# EAGLE design untitled (EAGLE 6.5.0)
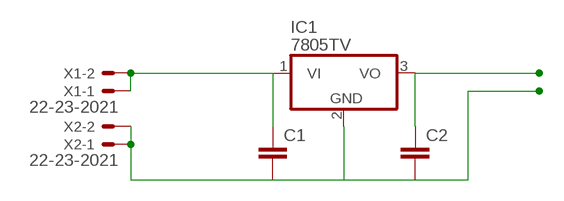
[diagram p0: schematic, sheet 1]

## Parts
C1  C-EUC1206  [C1206]
C2  C-EUC1206  [C1206]
IC1  7805TV  [TO220V]
X1  22-23-2021  [22-23-2021]
X2  22-23-2021  [22-23-2021]

## Nets
N$1: C1.1 IC1.1(VI) X1.1 X1.2
N$2: C1.2 C2.2 IC1.2(GND) X2.1 X2.2
N$3: C2.1 IC1.3(VO)

## Library data of the parts
C1 C2 = rcl:C-EU: CAPACITOR, European symbol
IC1 = linear:78*: Positive VOLTAGE REGULATOR Source: http://cache.national.com/ds/LM/LM78L05.pdf http://www.fairchildsemi.com/ds/LM/LM7805.pdf
X1 X2 = con-molex:22-23-2021: .100" (2.54mm) Center Header - 2 Pin; MF: MOLEX; MPN: 22-23-2021; OC_FARNELL: 1462926; OC_NEWARK: 25C3832

## Board
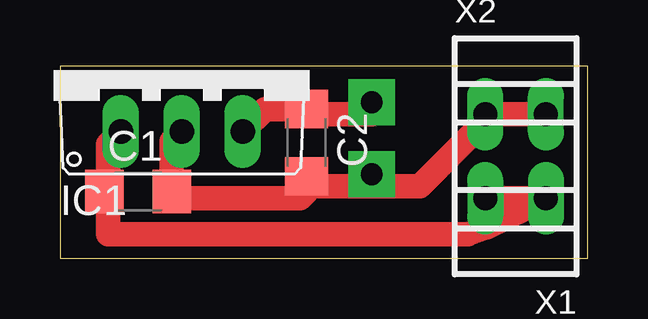
[diagram p1: board, top side]

Size 22 x 8 mm. Coordinates in mm from the lower left corner, seen from the top.
Outline: 0,0 22,0 22,8 0,8 0,0
Copper layers (1*16): Top 0.035mm / dielectric 1.5mm / Bottom 0.035mm
Design rules "default": minimum track width 10mil, minimum drill 24mil, track to track 8mil, track to pad 8mil, pad to pad 8mil, via to via 8mil, smd to smd 8mil, copper to edge 40mil, drill to drill 8mil, minimum pad ring 10mil, minimum via ring 8mil, stop-mask expansion 4mil, vias tented up to drill 0mil, thermal gap 10mil

### Footprints (pad centres in the part's own frame; a part is rotated, then mirrored left to right if it is on the bottom)
C1206 = smd 1.6 x 1.8: 1 -1.4,0; 2 1.4,0
TO220V = drill 1.016 long: 1 -2.54,-2.54; 2 0,-2.54; 3 2.54,-2.54
22-23-2021 = drill 1 long: 1 -1.27,0; 2 1.27,0

### Placement (x,y rotation side)
C1  3.26,2.78 0 top
C2  10.28,4.82 270 top
IC1  5.08,7.83 0 top
X1  19,2.5 180 top
X2  19,6 0 top

### Tracks (layer width: path | path; a pad name or v marks a point on that pad's centre or on a via)
N$1
  Top 1.016: X1.2 X1.1 17.73,1.27 17,1 2,1 2,2.64 | IC1.1 2,4.75 2,2.64 | C1.1 2,2.64
N$2
  Top 1.016: X2.2 X2.1 17.73,5.73 15,3 10.7,3 C2.2 10.28,2.78 10,2.5 4.94,2.5 C1.2 4.66,4.87 IC1.2
N$3
  Top 1.016: IC1.3 8.55,6.22 C2.1
N$5  (via drill 0.9 pad 1.93)
  other vias: 13,6.5
N$6  (via drill 0.9 pad 1.93)
  other vias: 13,3.5
N$7
  Top 1.016: 10,6 13,6